# EAGLE design LeDominoux (EAGLE 5.11)
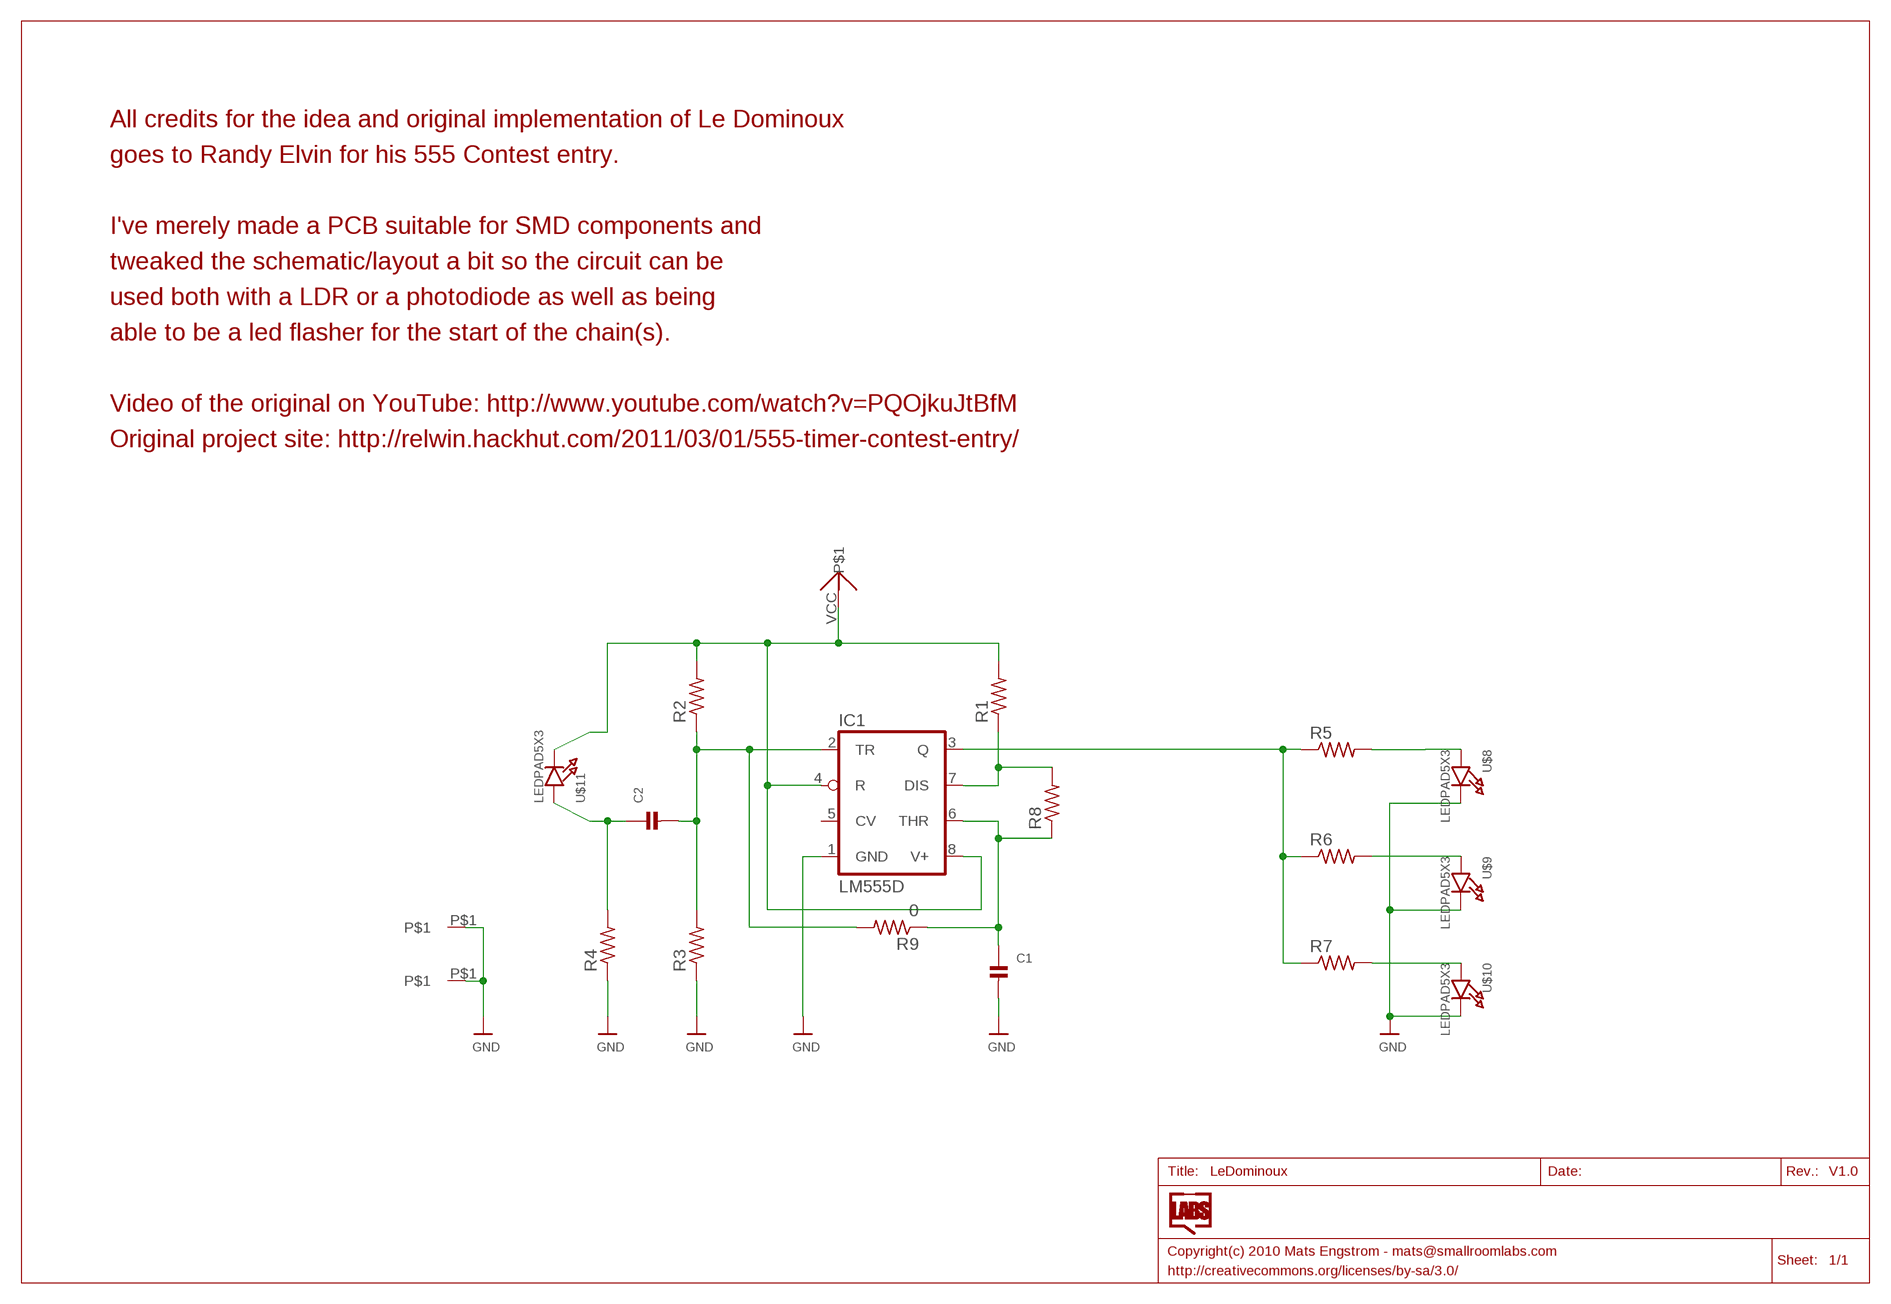
[diagram p0: schematic, sheet 1]

## Parts
C1  CAP_CERAMIC0805  [0805]
C2  CAP_CERAMIC0805  [0805]
GND  SINGECON1.2MM  [ROUND12]
IC1  LM555D  [SO08]
R1  R-US_R0805W  [R0805W]
R2  R-US_R0805W  [R0805W]
R3  R-US_R0805W  [R0805W]
R4  R-US_R0805W  [R0805W]
R5  R-US_R0805W  [R0805W]
R6  R-US_R0805W  [R0805W]
R7  R-US_R0805W  [R0805W]
R8  R-US_R0805W  [R0805W]
R9  0  R-US_R0805W  [R0805W]
U$8  LEDPAD5X3  [DUALPAD-5X3]
U$9  LEDPAD5X3  [DUALPAD-5X3]
U$10  LEDPAD5X3  [DUALPAD-5X3]
U$11  LEDPAD5X3  [DUALPAD-5X3]
U$13  SINGECON1.2MM  [ROUND12]
VCC  CR2032-POS-PAD  [CR2032-POSPAD]

## Nets
GND: C1.2 GND.P$1 IC1.1(GND) R3.1 R4.1 U$8.CATHODE(C) U$9.CATHODE(C) U$10.CATHODE(C) U$13.P$1
N$1: R6.2 U$9.ANODE(A)
N$2: R5.2 U$8.ANODE(A)
N$3: R7.2 U$10.ANODE(A)
N$4: IC1.3(Q) R5.1 R6.1 R7.1
N$5: C1.1 IC1.6(THR) R8.1 R9.1
N$7: C2.2 IC1.2(TR) R2.1 R3.2 R9.2
N$8: C2.1 R4.2 U$11.ANODE(A)
N$9: IC1.7(DIS) R1.1 R8.2
VCC: IC1.4(R) IC1.8(V+) R1.2 R2.2 U$11.CATHODE(C) VCC.VCC
Unconnected: IC1.5(CV)

## Notes on the sheet
- All credits for the idea and original implementation of Le Dominoux
- goes to Randy Elvin for his 555 Contest entry.
- I've merely made a PCB suitable for SMD components and
- tweaked the schematic/layout a bit so the circuit can be
- used both with a LDR or a photodiode as well as being
- able to be a led flasher for the start of the chain(s).
- Video of the original on YouTube: http://www.youtube.com/watch?v=PQOjkuJtBfM
- Original project site: http://relwin.hackhut.com/2011/03/01/555-timer-contest-entry/

## Library data of the parts
C1 C2 = microbuilder:CAP_CERAMIC: Ceramic Capacitors 0402 - 0402 Surface Mount Capacitors 0.1uF 10V 10% [Digikey: 490-1318-2-ND] 0603 - 0603 Surface Mount Capacitors 16 pF 50V 5% [Digikey: 445-5051-2-ND] 22 pF 50V [Digikey: PCC220ACVTR-ND] 33 pF 50V 5% [Digikey: 490-1415-1-ND] 56pF 50V 5% [Digikey: 490-1421-1-ND] 220pF 50V 5% [Digikey: 445-1285-1-ND] 680 pF 50V 2200 pF 50V 5% C0G [Digikey: 445-1297-1-ND] 5600 pF 100V 5% X7R [Digikey: 478-3711-1-ND] 0.1 µF 25V 10% [Digikey: PCC2277TR-ND] 0.22 µF 16V 10% X7R [Digikey: 445-1318-1-ND] 1.0 µF 25V 10% [Digikey: 445-5146-2-ND] 0603 - RF Specific 3pF 250V +/-0.1pF RF [Digikey: 712-1347-1-ND] 18 pF 250V 5% [Digikey: 478-3505-1-ND or 712-1322-1-ND] 56 pF 250V 5% C0G RF [Digikey: 490-4867-1-ND] 68 pF 250V RF [Digikey: 490-4868-1-ND] 0805 - 0805 Surface Mount Capacitors 220 pF 250V 2% RF Ceramic Capacitor [Digikey: 712-1398-1-ND] 1000 pF 50V 2% NP0 Ceramic Capacitor [Digikey: 478-3760-1-ND] 0.1 µF 25V 10% Ceramic Capacitor [Digikey: PCC1828TR-ND] 1.0 µF 16V 10% Ceramic Capacitor[Digikey: 490-1691-2-ND] 10.0 µF 10V 10% Ceramic Capacitor[Digikey: 709-1228-1-ND] 1206 - 1206 Surface Mount Capacitors
GND U$13 = SmallRoomLabs:SINGECON
IC1 = adafruit:*555: TIMER Changed DIP package to have round (not oval) pin pads http://www.ladyada.net/library/pcb/eaglelibrary.html
R1-R9 = adafruit:R-US_: RESISTOR, American symbol
U$8-U$11 = SmallRoomLabs:LED
VCC = SmallRoomLabs:CR2032-POS-PAD

## Net classes
0 default: width 0.305 mm, clearance 0.305 mm

## Board
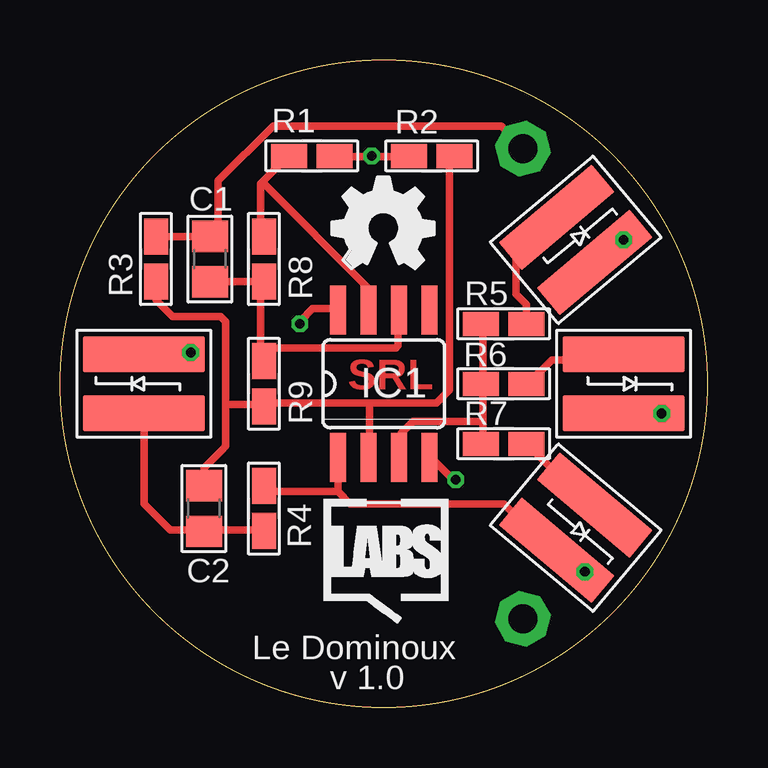
[diagram p1: board, top side]
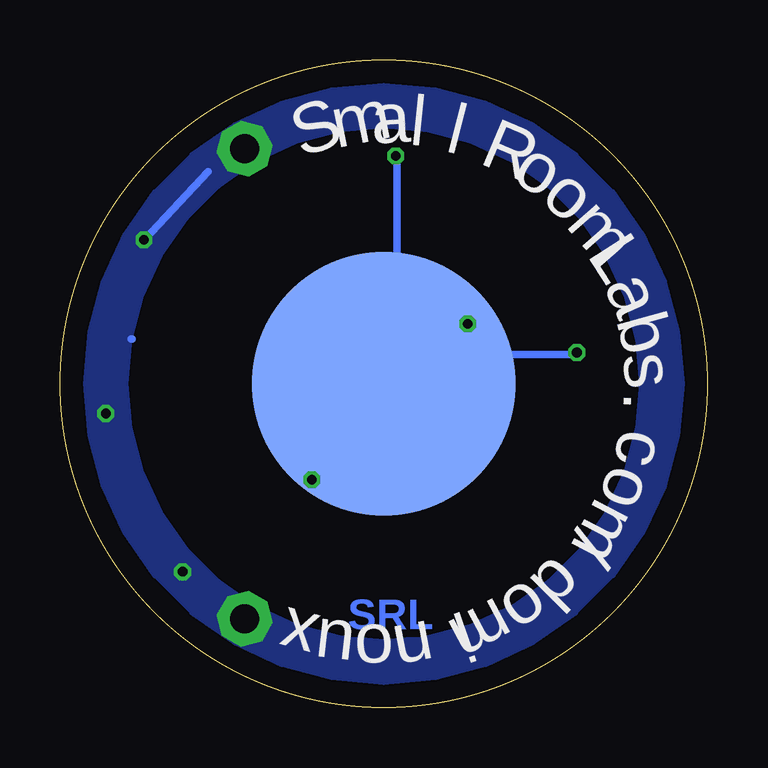
[diagram p2: board, bottom side, seen from below]

Size 27 x 27 mm. Coordinates in mm from the lower left corner, seen from the top.
Outline: circle at 13.5,13.5 radius 13.5
Copper layers (1*16): Top 0.035mm / dielectric 1.5mm / Bottom 0.035mm
Design rules "ITead_rule": minimum track width 6mil, minimum drill 12mil, track to track 6mil, track to pad 6mil, pad to pad 6mil, via to via 6mil, smd to smd 0mil, copper to edge 10mil, drill to drill 10mil, minimum pad ring 10mil, minimum via ring 6mil, stop-mask expansion 2mil, vias tented up to drill 100mil, thermal gap 10mil
vRestrict: area 11.5,11.5 to 15.5,15.5

### Footprints (pad centres in the part's own frame; a part is rotated, then mirrored left to right if it is on the bottom)
0805 = smd 1.3 x 1.5: 1 -0.95,0; 2 0.95,0
ROUND12 = drill 1.2 pad 2.184 octagon: P$1 0,0
SO08 = smd 0.66 x 2.032: 1 -1.905,-3.073; 2 -0.635,-3.073; 3 0.635,-3.073; 4 1.905,-3.073; 5 1.905,3.073; 6 0.635,3.073; 7 -0.635,3.073; 8 -1.905,3.073
R0805W = smd 1.5 x 1: 1 -0.94,0; 2 0.94,0
DUALPAD-5X3 = smd 5.08 x 1.524: ANODE 0,1.23; CATHODE 0,-1.23
CR2032-POSPAD = smd 11 x 11: VCC 0,0

### Placement (x,y rotation side)
C1  6.25,18.7 90 top
C2  6,8.3 90 top
GND  19.3,3.7 30 top
IC1  13.5,13.5 0 top
R1  10.5,23 0 top
R2  15.5,23 180 top
R3  4,18.7 270 top
R4  8.5,8.3 270 top
R5  18.5,16 0 top
R6  18.5,13.5 0 top
R7  18.5,11 0 top
R8  8.5,18.7 90 top
R9  8.5,13.5 270 top
U$7  [SRL-LOGO-TPLACE-5MM]  11,3.5 0 top
U$8  21.5,19.5 40 top
U$9  23.5,13.5 0 top
U$10  21.5,7.5 320 top
U$11  3.5,13.5 180 top
U$13  19.3,23.3 15 top
U$15  [OSHW_FILLX150_NOTEXT]  11.35,18.3 0 top
VCC  13.5,13.5 0 bottom

### Tracks (layer width: path | path; a pad name or v marks a point on that pad's centre or on a via)
GND  (via drill 0.4)
  Top 0.305: U$9.CATHODE 23.49,12.18 | U$8.CATHODE 22.34,18.53 v23.5,19.5 | IC1.1 11.55,10.41 | IC1.1 11.55,10.28 | U$9.CATHODE 23.49,12.06 | 11.6,9.01 IC1.1 | 11.6,9.01 12.1,8.5 18.5,8.5 19.5,7.5 19.77,7.5 U$10.CATHODE v21.89,5.66 | 11.6,9.01 9.99,9.01 8.73,9.01 R4.1 8.56,9.5 | R3.1 6.49,19.64 C1.2 6.6,19.68 6.6,21.96 8.88,24.25 17.64,24.25 17.75,24.25 17.9,24.25 18.41,24.25 19.3,23.36 U$13.P$1 | U$9.CATHODE v25.09,12.26
  Bottom 0.305: v23.5,19.5 20.82,22.34 | 24,15.36 24.03,15.37
  pour Bottom: 26,13.49 24.2,13.49 24.04,15.37 25.81,15.68
  pour Bottom: 25.81,15.66 24.04,15.35 23.55,17.17 25.24,17.79
  pour Bottom: 25.25,17.77 23.56,17.15 22.76,18.86 24.32,19.76
  pour Bottom: 24.33,19.74 22.77,18.84 21.69,20.39 23.07,21.54
  pour Bottom: 23.08,21.53 21.7,20.37 20.37,21.7 21.53,23.08
  pour Bottom (no thermals): 21.54,23.07 20.39,21.69 18.84,22.77 19.74,24.33
  pour Bottom (no thermals): 19.76,24.32 18.86,22.76 17.15,23.56 17.77,25.25
  pour Bottom: 17.79,25.24 17.17,23.55 15.35,24.04 15.66,25.81
  pour Bottom: 15.68,25.81 15.37,24.04 13.49,24.2 13.49,26
  pour Bottom: 13.51,26 13.51,24.2 11.63,24.04 11.32,25.81
  pour Bottom: 11.34,25.81 11.65,24.04 9.83,23.55 9.21,25.24
  pour Bottom: 9.23,25.25 9.85,23.56 8.14,22.76 7.24,24.32
  pour Bottom: 7.26,24.33 8.16,22.77 6.62,21.69 5.46,23.07
  pour Bottom: 5.47,23.08 6.63,21.7 5.3,20.37 3.92,21.53
  pour Bottom: 3.93,21.54 5.31,20.39 4.23,18.84 2.67,19.74
  pour Bottom: 2.68,19.76 4.24,18.86 3.44,17.15 1.75,17.77
  pour Bottom: 1.76,17.79 3.45,17.17 2.96,15.35 1.19,15.66
  pour Bottom: 1.19,15.68 2.96,15.37 2.8,13.49 1,13.49
  pour Bottom: 1,13.51 2.8,13.51 2.96,11.63 1.19,11.32
  pour Bottom: 1.19,11.34 2.96,11.65 3.45,9.83 1.76,9.21
  pour Bottom: 1.75,9.23 3.44,9.85 4.24,8.14 2.68,7.24
  pour Bottom: 2.67,7.26 4.23,8.16 5.31,6.62 3.93,5.46
  pour Bottom: 3.92,5.47 5.3,6.63 6.63,5.3 5.47,3.92
  pour Bottom: 5.46,3.93 6.62,5.31 8.16,4.23 7.26,2.67
  pour Bottom: 7.24,2.68 8.14,4.24 9.85,3.44 9.23,1.75
  pour Bottom: 9.21,1.76 9.83,3.45 11.65,2.96 11.34,1.19
  pour Bottom: 11.32,1.19 11.63,2.96 13.51,2.8 13.51,1
  pour Bottom: 13.49,1 13.49,2.8 15.37,2.96 15.68,1.19
  pour Bottom: 15.66,1.19 15.35,2.96 17.17,3.45 17.79,1.76
  pour Bottom (no thermals): 17.77,1.75 17.15,3.44 18.86,4.24 19.76,2.68
  pour Bottom (no thermals): 19.74,2.67 18.84,4.23 20.39,5.31 21.54,3.93
  pour Bottom (no thermals): 21.53,3.92 20.37,5.3 21.7,6.63 23.08,5.47
  pour Bottom: 23.07,5.46 21.69,6.62 22.77,8.16 24.33,7.26
  pour Bottom: 24.32,7.24 22.76,8.14 23.56,9.85 25.25,9.23
  pour Bottom: 25.24,9.21 23.55,9.83 24.04,11.65 25.81,11.34
  pour Bottom: 25.81,11.32 24.04,11.63 24.2,13.51 26,13.51
N$1
  Top 0.305: U$9.ANODE 23.5,14.44 | R6.2 19.55,13.58 19.58,13.58 20.5,14.5 23.27,14.5 U$9.ANODE | U$9.ANODE 23.36,14.47
N$2
  Top 0.305: U$8.ANODE 20.69,20.44 | 19.55,19.42 20.57,20.44 U$8.ANODE | 19.3,19.04 19.55,19.3 20.13,19.87 | 20.13,19.87 U$8.ANODE | R5.2 19.44,16.81 19,17.25 19,18.74 20.13,19.87
N$3
  Top 0.305: 22.22,8.5 U$10.ANODE 22.09,8.5 21.96,8.5 19.55,10.91 R7.2
N$4
  Top 0.305: IC1.3 14.22,10.53 | 17.64,11.93 17.64,11.04 R7.1 | 17.64,11.93 17.64,13.45 R6.1 | 17.64,15.99 R5.1 17.64,15.87 17.64,13.71 R6.1 | R6.1 17.64,13.58 | 14.22,11.29 14.22,10.66 IC1.3 | 17.64,11.93 17.52,11.93 14.72,11.93 14.22,11.42 IC1.3
N$5
  Top 0.305: 6.5,17.56 C1.1 6.51,17.76 R8.1 | IC1.6 14.09,16.5 14.09,15.09 14,15 8.37,15 | R8.1 8.37,17.52 | 8.37,15 8.37,14.47 R9.1 8.5,14.47 | 8.37,15 8.37,17.39 R8.1
N$7
  Top 0.305: 12.95,10.53 IC1.2 12.95,10.66 12.95,11.29 12.9,11.34 12.9,12.7 | R2.1 16.38,22.98 | R2.1 16.38,22.85 | R9.2 8.37,12.64 6.96,12.64 6.9,12.5 | R2.1 16.38,22.73 | R9.2 8.63,12.56 | R2.1 16.25,22.81 16.25,16.63 16.25,14.6 16.25,14.25 16.25,13.25 15.7,12.7 12.9,12.7 | 12.9,12.7 8.56,12.7 R9.2 | 6.9,12.5 6.9,16.1 6.7,16.3 4.7,16.3 4,17 R3.2 | 6.9,12.5 6.9,10.9 6.75,10.75 6,10 C2.2
N$8
  Top 0.305: C2.1 6.47,7.41 6.21,7.41 4.59,7.41 3.5,8.5 U$11.ANODE | R4.2 8.37,7.41 6.56,7.41 C2.1 | C2.1 6.6,7.41 | C2.1 6.45,7.5
N$9
  Top 0.305: 8.37,19.55 R8.2 8.37,19.68 8.37,21.84 | 12.82,17.39 12.82,16.63 IC1.7 12.82,17.52 8.5,21.84 8.37,21.84 | 8.37,21.84 9.52,22.98 R1.1
VCC  (via drill 0.4)
  Top 0.305: R2.2 14.31,22.75 | R1.2 11.55,22.99 | R2.2 14.34,22.99 | R2.2 14.22,22.99 | R1.2 11.68,22.99 | R2.2 14.09,22.98 13.07,22.98 v13,23 12.95,22.98 11.8,22.98 R1.2 | IC1.4 15.49,10.41 16.38,9.52 v16.5,9.5 | 11.55,16.63 IC1.8 11.42,16.63 10.53,16.63 10.03,16.12 v10,16 | U$11.CATHODE 3.55,14.72 5.45,14.72 v5.45,14.8
  Bottom 0.305: VCC.VCC 12.5,13.5 v10,16 10,14.72 5.45,14.72 v5.45,14.8 | v16.5,9.5 14.5,13.5 VCC.VCC | v13,23 12.95,22.98 12.95,13.58 VCC.VCC | VCC.VCC 11.29,15.61 | VCC.VCC 9.9,15.99 | VCC.VCC 11.17,14.72

### Text on the board
Top: SRL
Bottom: SRL
tPlace: Le Dominoux | v 1.0
bPlace: R | l | l | a | m | S | o | o | m | L | a | b | s | . | c | o | m | / | d | o | m | i | n | o | u | x